# EasyEDA Pro project ProPrj_MCC_2024_final_2024-12-02.epro

# Schematic MCC_2024_V1
Board Name: MCC_2024_V1; Create Date: 2024-10-15; Page Name: P1; Project Name: MCC_2024_final; Schematic Name: MCC_2024_V1; Update Date: 2024-10-15; Company: alejnd; Drawn: naja; Page Size: A4; Part Number: JLCPCB-002; Reviewed: nikk0r; Version: V0.1
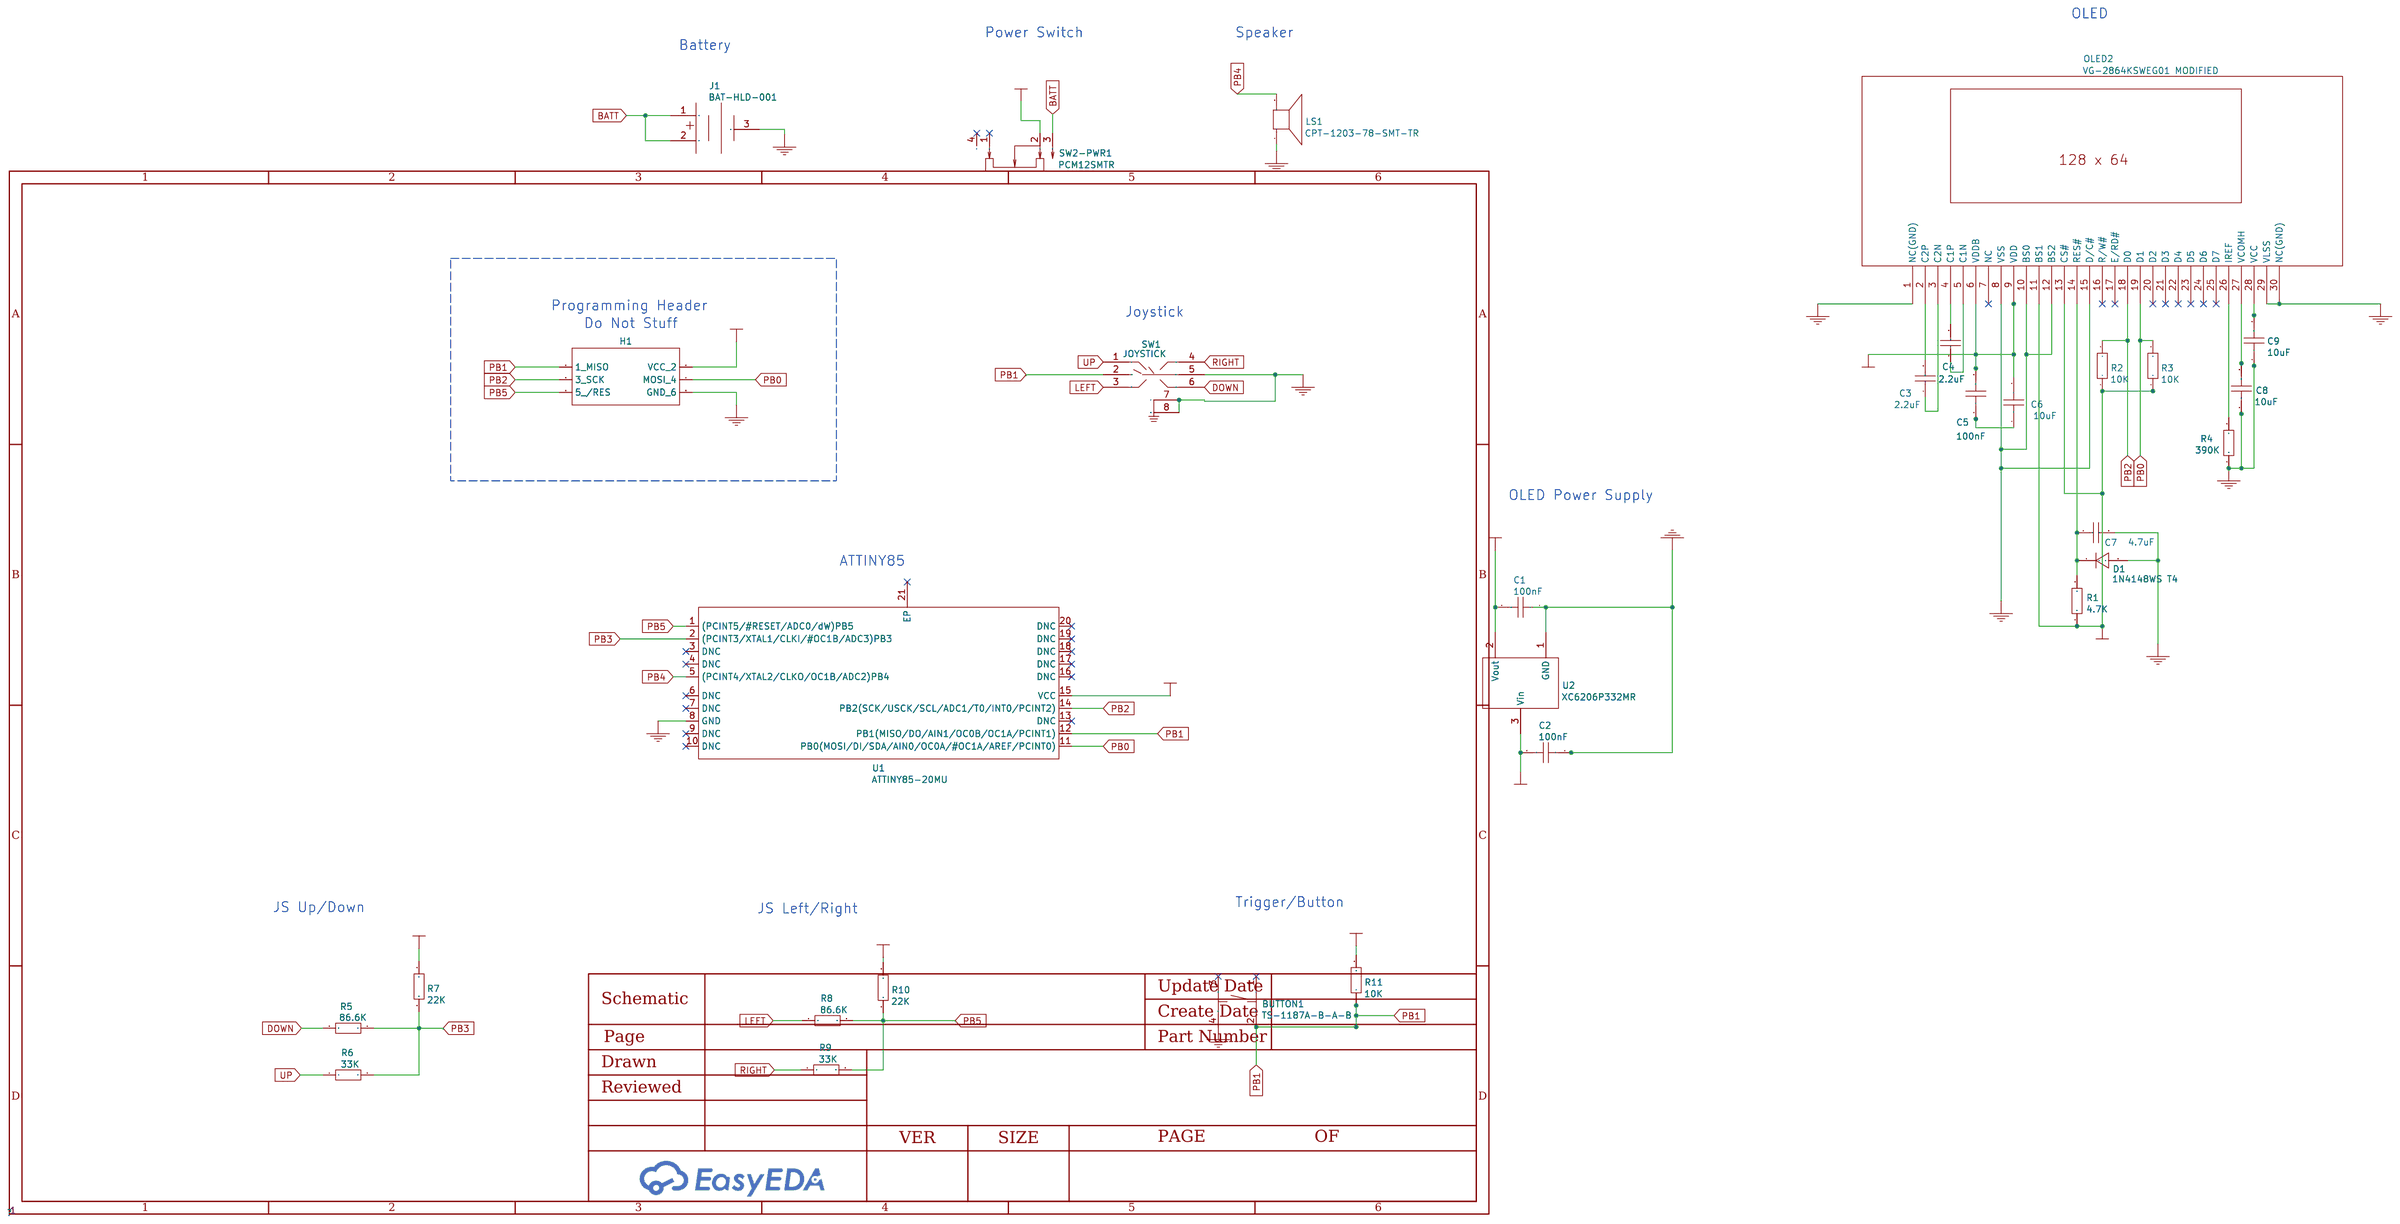
[diagram p0: schematic sheet]

## Parts
BUTTON1  TS-1187A-B-A-B  [SW-SMD_4P-L5.1-W5.1-P3.70-LS6.4]
C1  100nF  [C0603]
C2  100nF  [C0603]
C3  2.2uF  [C0603]
C4  2.2uF  [C0603]
C5  100nF  [C0603]
C6  10uF  [C0603]
C7  4.7uF  [C0603]
C8  10uF  [C0603]
C9  10uF  [C0603]
D1  1N4148WS T4  [SOD-323_L1.8-W1.3-LS2.5-RD]
H1  ISP HEADER  [HDR-TH_6P-P2.54-V-R2-C3-S2.54]
J1  BAT-HLD-001  [BAT-HLD-001]
LS1  CPT-1203-78-SMT-TR  [XDCR_CPT-1203-78-SMT-TR]
OLED2  VG-2864KSWEG01 MODIFIED  [OLED_0.96-30P-P0.70-12864]
R1  4.7K  [R0603]
R2  10K  [R0603]
R3  10K  [R0603]
R4  390K  [R0603]
R5  86.6K  [R0603]
R6  33K  [R0603]
R7  22K  [R0603]
R8  86.6K  [R0603]
R9  33K  [R0603]
R10  22K  [R0603]
R11  10K  [R0603]
SW1  JOYSTICK  [SW-SMD_SKRHADE010]
SW2-PWR1  PCM12SMTR  [SW-SMD_PCM12SMTR]
U1  ATTINY85-20MU  [QFN-20_L4.0-W4.0-P0.50-BL-EP]
U2  XC6206P332MR  [SOT-23-3_L2.9-W1.6-P1.90-LS2.8-BR]

## Library data of the parts
BUTTON1 = TS-1187A-B-A-B: Supplier: LCSC; Supplier Part: C318884; Manufacturer: XKB Enterprise; JLCPCB Part Class: Extend
C1 C2 C5 = CC0603KRX7R9BB104: Supplier: LCSC; Manufacturer: YAGEO; Supplier Part: C14663; JLCPCB Part Class: Basic
C3 C4 = CL10A225KO8NNNC: Supplier: LCSC; Manufacturer: SAMSUNG; Supplier Part: C23630; JLCPCB Part Class: Basic
C6 C8 C9 = CL10A106KP8NNNC: Supplier: LCSC; Manufacturer: SAMSUNG; Supplier Part: C19702; JLCPCB Part Class: Basic
C7 = CL10A475KO8NNNC: Supplier: LCSC; Manufacturer: SAMSUNG; Supplier Part: C19666; JLCPCB Part Class: Basic
D1 = 1N4148WS T4: Supplier: LCSC; Manufacturer: CJ; image: //image.lceda.cn/szlcsc/C2128.jpg; Supplier Part: C2128; JLCPCB Part Class: Basic
H1 = DS1023-2*3SF11: Supplier: LCSC; Manufacturer: CONNFLY; Supplier Part: C92272
J1 = BAT-HLD-001
LS1 = CUI Devices: Supplier: Mouser; Supplier Part: 490-CPT-1203-78SMTTR
OLED2 = VG-2864KSWEG01: Supplier: LCSC; Supplier Part: C194313; Manufacturer: WiseChip
R1 = 0603WAF4701T5E: Supplier: LCSC; Manufacturer: UniOhm; Supplier Part: C23162; JLCPCB Part Class: Basic
R2 R3 R11 = 0603WAF1002T5E: Supplier: LCSC; Manufacturer: UniOhm; Supplier Part: C25804; JLCPCB Part Class: Basic
R4 = 0603WAF3903T5E: Supplier: LCSC; Manufacturer: UniOhm; Supplier Part: C23150; JLCPCB Part Class: Basic
R5 R8 = 0603WAF8662T5E: Supplier: LCSC; Manufacturer: UniOhm; Supplier Part: C23121; JLCPCB Part Class: Extend
R6 R9 = 0603WAF3302T5E: Supplier: LCSC; Manufacturer: UniOhm; Supplier Part: C4216; JLCPCB Part Class: Basic
R7 R10 = 0603WAF2202T5E: Supplier: LCSC; Manufacturer: UniOhm; Supplier Part: C31850; JLCPCB Part Class: Basic
SW1 = SKRHADE011: Supplier: LCSC; Supplier Part: C602036; Manufacturer: ALPS Electric
SW2-PWR1 = PCM12SMTR: Supplier: LCSC; Supplier Part: C221841; Manufacturer: C&K
U1 = ATTINY85-20MU: Supplier: LCSC; Supplier Part: C1337171; Manufacturer: Microchip Tech; JLCPCB Part Class: Extended Part
U2 = XC6206P332MR: Supplier: LCSC; Manufacturer: TOREX; image: //image.lceda.cn/szlcsc/C5446.jpg; Supplier Part: C5446; JLCPCB Part Class: Basic

## Nets
3.3V: C1.2 C5.2 C6.2 OLED2.6(VDDB) OLED2.9(VDD) OLED2.11(BS1) OLED2.13(CS#) R1.1 R2.1 R3.1 U2.2(Vout)
GND: BUTTON1.4(D) C1.1 C2.1 C7.2 C8.1 C9.1 D1.2(A) H1.6(GND 6) J1.3(2) LS1.N OLED2.1(NC(GND)) OLED2.8(VSS) OLED2.10(BS0) OLED2.12(BS2) OLED2.15(D/C#) OLED2.29(VLSS) OLED2.30(NC(GND)) R4.1 SW1.5(COM) SW1.7 SW1.8 U1.8(GND) U2.1(GND)
VCC: C2.2 H1.2(VCC 2) R7.1 R10.2 R11.2 SW2-PWR1.2 U1.15(VCC) U2.3(Vin)
BATT: J1.1 J1.2(1) SW2-PWR1.3
DOWN: R5.2 SW1.6(D)
LEFT: R8.1 SW1.3(C)
PB0: H1.4(MOSI 4) OLED2.19(D1) R3.2 U1.11(PB0(MOSI/DI/SDA/AIN0/OC0A/#OC1A/AREF/PCINT0))
PB1: BUTTON1.2(B) H1.1(1 MISO) R11.1 SW1.2(CEN) U1.12(PB1(MISO/DO/AIN1/OC0B/OC1A/PCINT1))
PB2: H1.3(3 SCK) OLED2.18(D0) R2.2 U1.14(PB2(SCK/USCK/SCL/ADC1/T0/INT0/PCINT2))
PB3: R5.1 R6.2 R7.2 U1.2((PCINT3/XTAL1/CLKI/#OC1B/ADC3)PB3)
PB4: LS1.P U1.5((PCINT4/XTAL2/CLKO/OC1B/ADC2)PB4)
PB5: H1.5(5 /RES) R8.2 R9.2 R10.1 U1.1((PCINT5/#RESET/ADC0/dW)PB5)
RIGHT: R9.1 SW1.4(B)
UP: R6.1 SW1.1(A)
$1N1548: C7.1 D1.1(K) OLED2.14(RES#) R1.2
$1N1551: C5.1 C6.1
$1N1555: C9.2 OLED2.28(VCC)
$1N1556: C8.2 OLED2.27(VCOMH)
$1N1559: C3.1 OLED2.3(C2N)
$1N1560: C3.2 OLED2.2(C2P)
$1N1564: OLED2.26(IREF) R4.2
$1N1567: C4.2 OLED2.4(C1P)
$1N1568: C4.1 OLED2.5(C1N)

Not connected (* = marked no-connect by the designer): BUTTON1 1(A)* 3(C)*; OLED2 7(NC)* 16(R/W#)* 17(E/RD#)* 20(D2)* 21(D3)* 22(D4)* 23(D5)* 24(D6)* 25(D7)*; SW2-PWR1 1* 4*; U1 3(DNC)* 4(DNC)* 6(DNC)* 7(DNC)* 9(DNC)* 10(DNC)* 13(DNC)* 16(DNC)* 17(DNC)* 18(DNC)* 19(DNC)* 20(DNC)* 21(EP)*

## Notes on the sheet
- OLED
- Power Switch
- Speaker
- Battery
- Programming Header
- Joystick
- Do Not Stuff
- OLED Power Supply
- ATTINY85
- Trigger/Button
- JS Up/Down
- JS Left/Right

# Board MCC_2024_V1
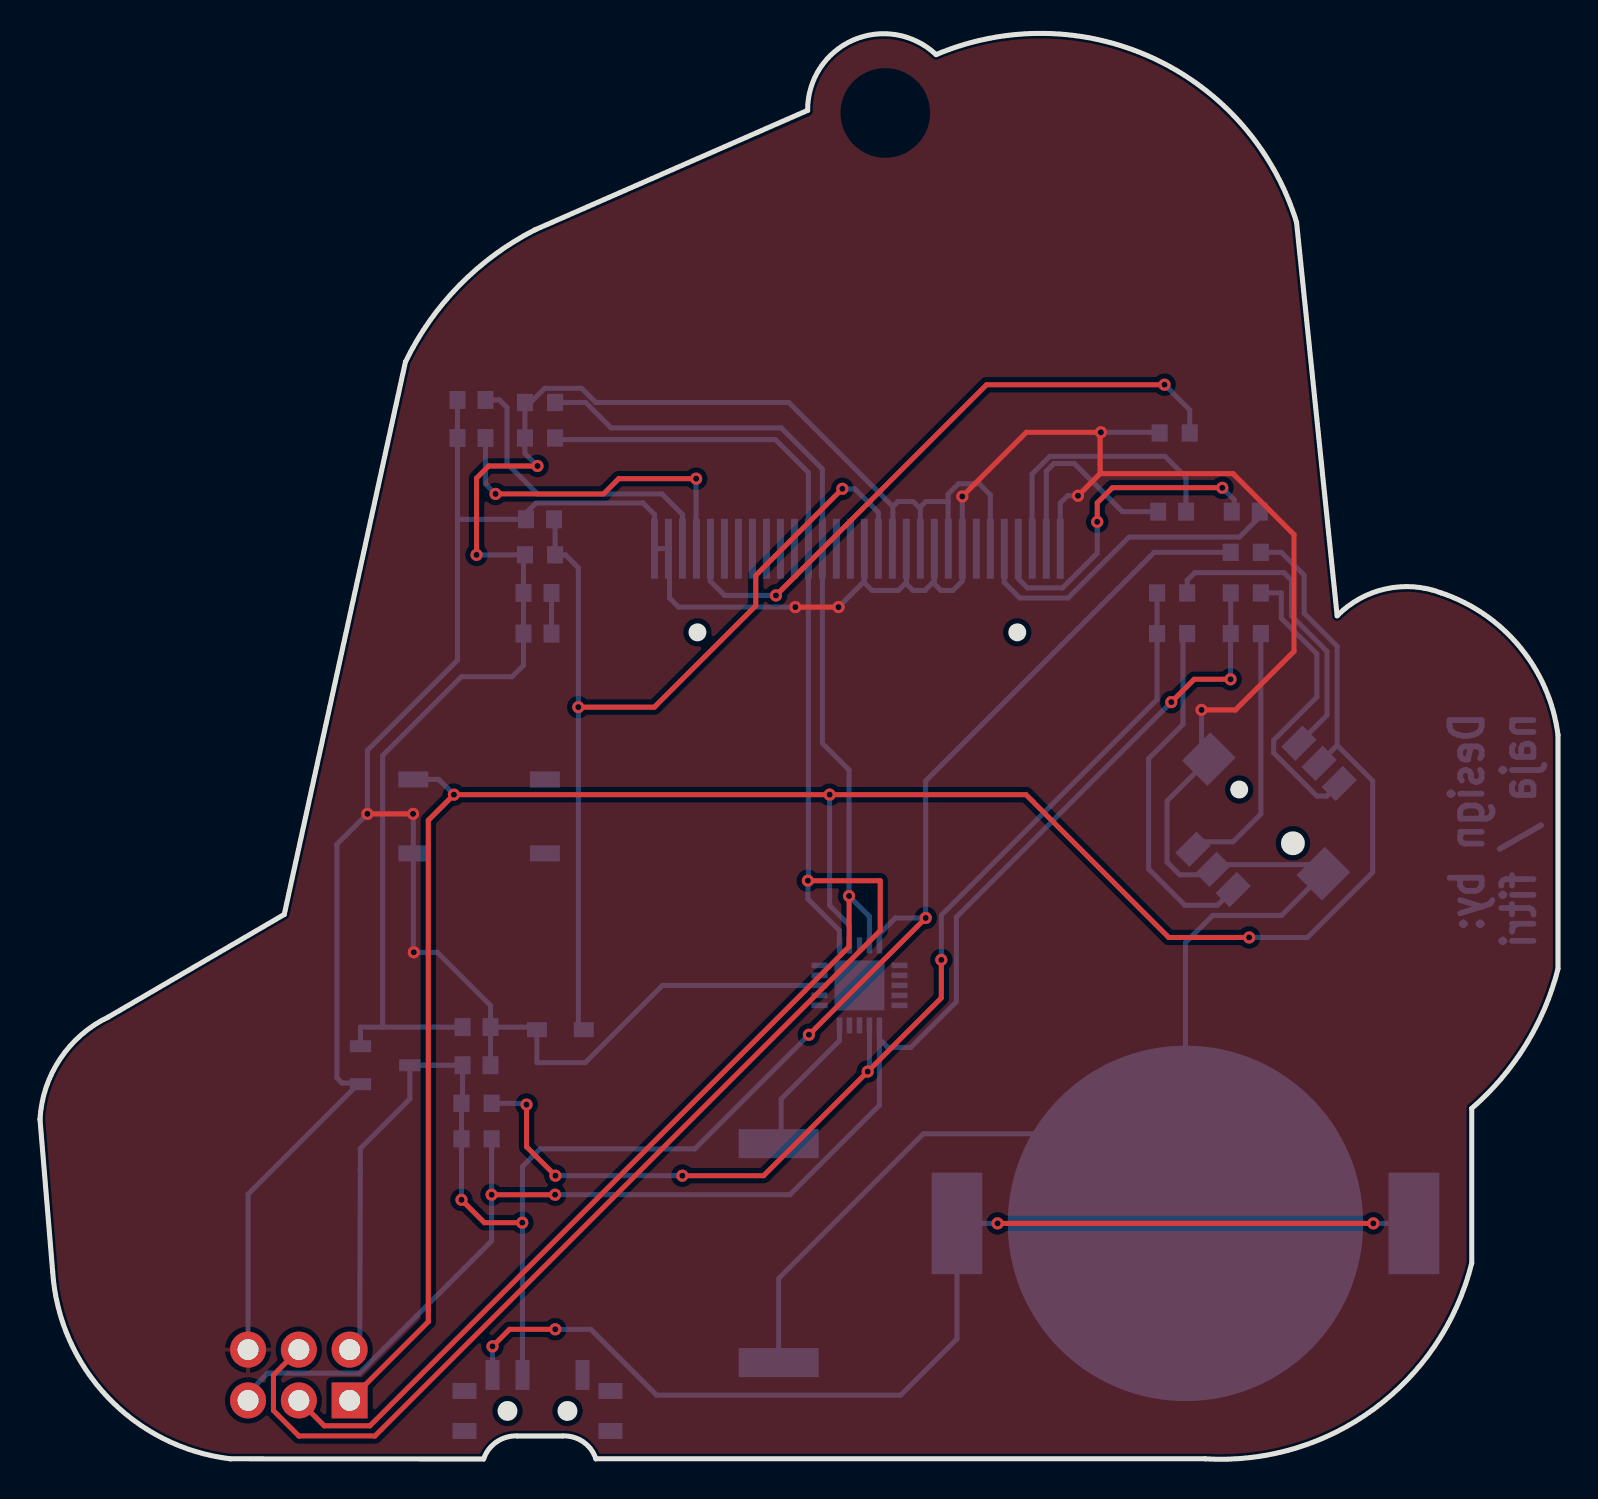
[diagram p1: board, top side]
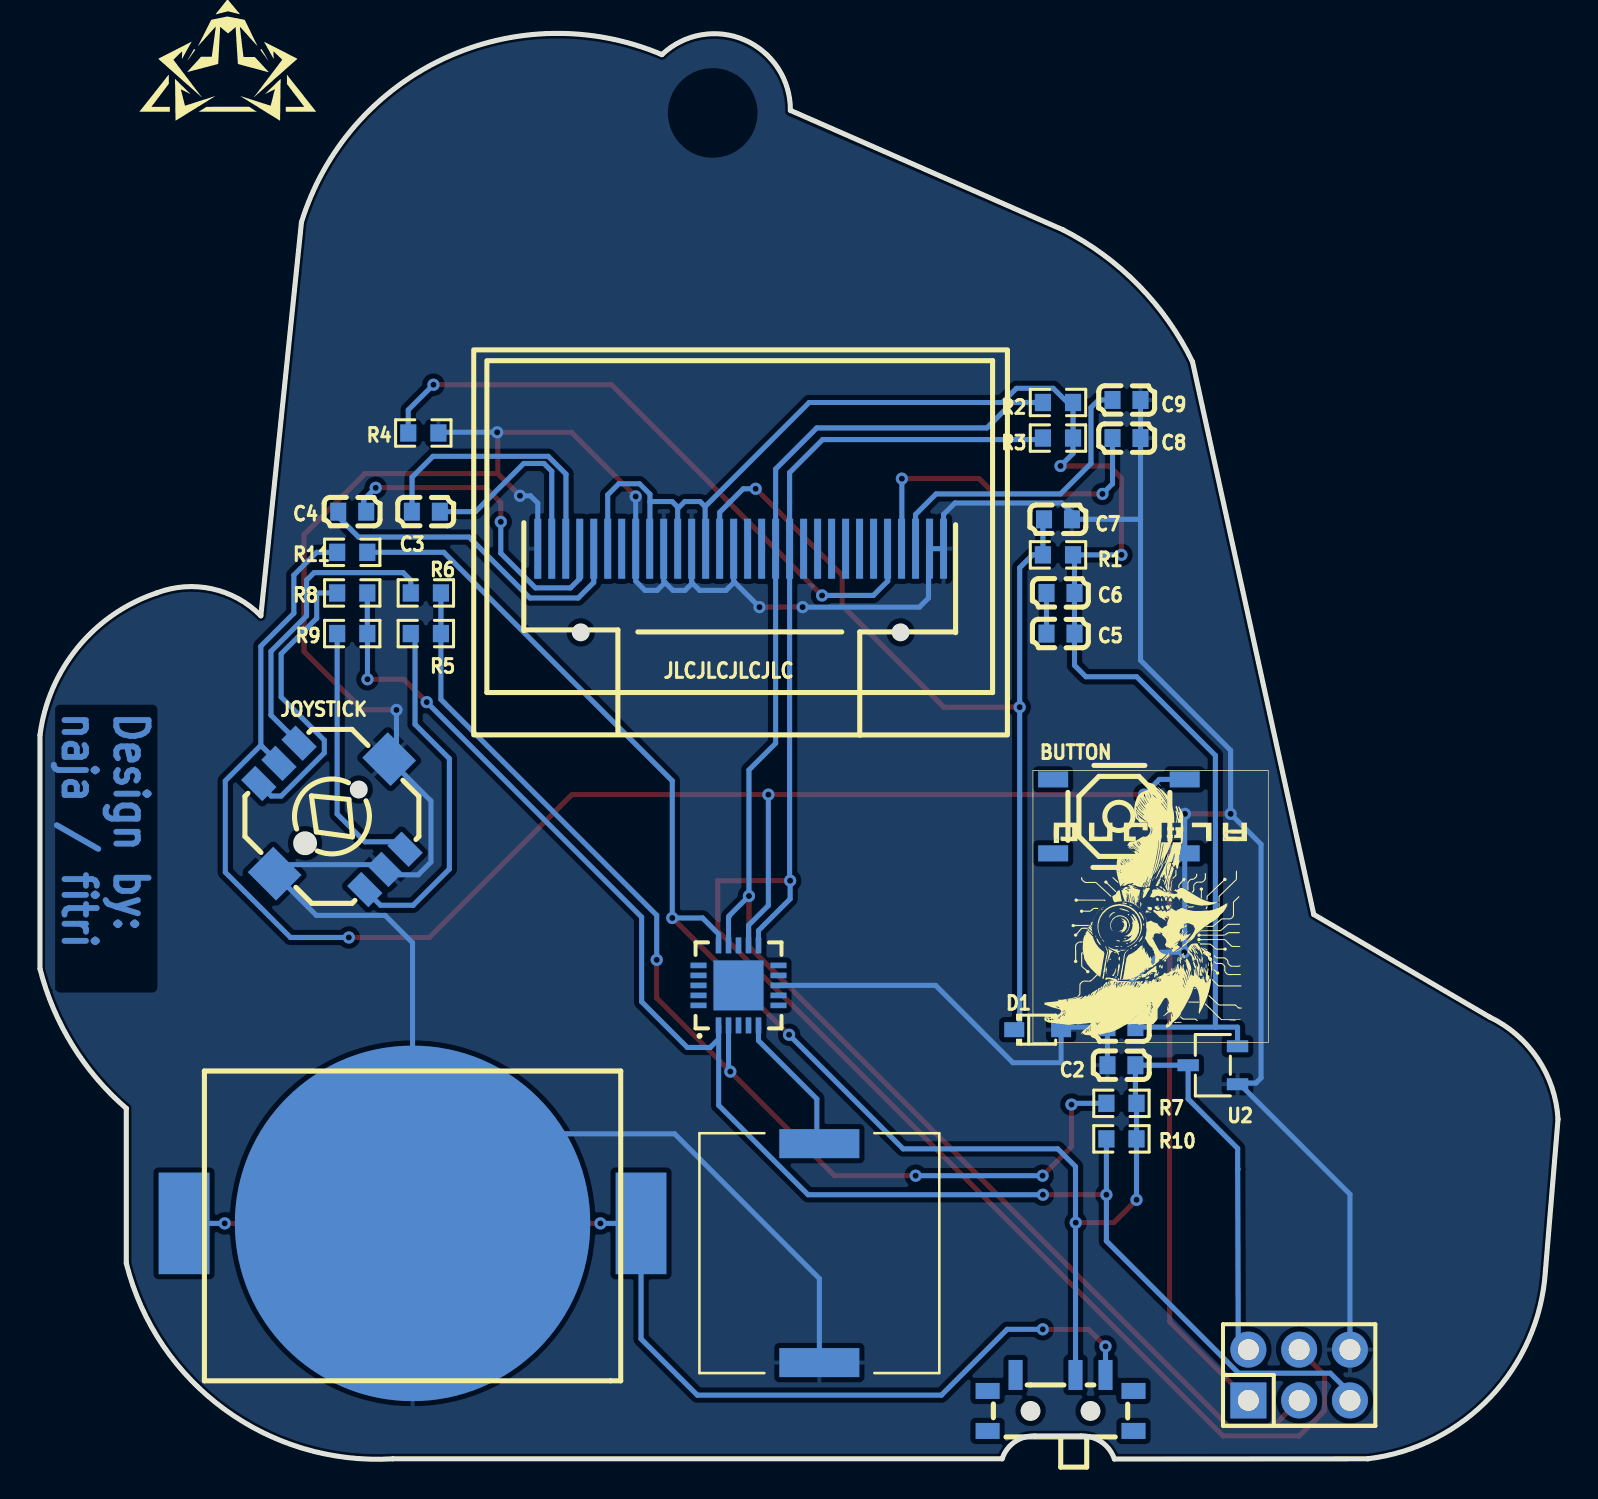
[diagram p2: board, bottom side, seen from below]

Outline 75.94 x 71.32 mm; copper layers: Top Layer, Bottom Layer. Coordinates in mm from the lower left corner of the outline.
Outline path: 0,17.01 arc(1.01,20.03) 3.42,22.12 12.22,27.25 18.28,54.89 arc(20.98,58.72) 24.76,61.49 38.4,67.47 arc(40.69,70.99) 44.83,70.25 arc(55.71,70.07) 62.86,61.87 64.89,42.19 arc(67.33,43.53) 70.1,43.33 arc(74.04,40.61) 75.94,36.22 75.94,24.53 arc(74.32,20.71) 71.62,17.55 71.62,9.8 arc(66.72,2.51) 58.29,0.02 27.81,0.02 arc(27.18,0.87) 26.16,1.17 23.87,1.17 arc(22.84,0.87) 22.19,0.01 9.52,0.02 arc(3.38,3.12) 0.63,9.42 0,17.01
Stack: Top Layer 0.035mm / Dielectric1 1.51mm FR4 er 4.5 / Bottom Layer 0.035mm

## Design rules (mm)
template: JLCPCB Capability(Two Layers Board)
spacing copperThickness1oz (default): track to track 0.102, other pairs 0.152 to 0.3
spacing copperThickness2oz: track to track 0.203, other pairs 0.152 to 0.3
track width copperThickness1oz (default): min 0.127, default 0.254, max 2.54
track width copperThickness2oz: min 0.203, default 0.254, max 2.54
differential pair differentialPair (default): width min 0.127, default 0.254, max 2.54; gap min 0.152, default 0.152
via viaSize (default): diameter min 0.5, default 0.61, max 10; hole min 0.3, default 0.305, max 6.3

## Placement (name value [footprint] x y rotation side)
BUTTON  TS-1187A-B-A-B  [SW-SMD_4P-L5.1-W5.1-P3.70-LS6.4]  21.97 32.15 180 bottom
C1  100nF  [C0603]  21.84 21.61 180 bottom
C2  100nF  [C0603]  21.84 19.71 180 bottom
C3  2.2uF  [C0603]  56.64 47.39 180 bottom
C4  2.2uF  [C0603]  60.32 47.39 180 bottom
C5  100nF  [C0603]  24.89 41.3 180 bottom
C6  10uF  [C0603]  24.89 43.33 180 bottom
C7  4.7uF  [C0603]  25.01 47.01 180 bottom
C8  10uF  [C0603]  21.59 51.08 0 bottom
C9  10uF  [C0603]  21.59 52.98 0 bottom
D1  1N4148WS T4  [SOD-323_L1.8-W1.3-LS2.5-RD]  26.03 21.49 180 bottom
H1  ISP HEADER  [HDR-TH_6P-P2.54-V-R2-C3-S2.54]  12.95 4.21 180 bottom
J1  -  [BAT-HLD-001]  57.3 11.8 0 bottom
JOYSTICK  JOYSTICK  [SW-SMD_SKRHADE010]  61.34 32.15 270 bottom
LS1  CPT-1203-78-SMT-TR  [XDCR_CPT-1203-78-SMT-TR]  36.95 10.31 180 bottom
OLED2  VG-2864KSWEG01 MODIFIED  [OLED_0.96-30P-P0.70-12864]  41.14 22.63 180 bottom
R1  4.7K  [R0603]  25.01 45.24 0 bottom
R2  10K  [R0603]  25.01 52.86 0 bottom
R3  10K  [R0603]  25.01 51.08 0 bottom
R4  390K  [R0603]  56.76 51.33 0 bottom
R5  86.6K  [R0603]  56.64 41.3 0 bottom
R6  33K  [R0603]  56.64 43.33 180 bottom
R7  22K  [R0603]  21.84 17.8 0 bottom
R8  86.6K  [R0603]  60.32 43.33 180 bottom
R9  33K  [R0603]  60.32 41.3 180 bottom
R10  22K  [R0603]  21.84 16.03 180 bottom
R11  10K  [R0603]  60.32 45.36 180 bottom
SW2-PWR1  PCM12SMTR  [SW-SMD_PCM12SMTR]  24.89 2.82 180 bottom
U1  ATTINY85-20MU  [QFN-20_L4.0-W4.0-P0.50-BL-EP]  41 23.7 180 bottom
U2  XC6206P332MR  [SOT-23-3_L2.9-W1.6-P1.90-LS2.8-BR]  17.27 19.71 180 bottom

## Footprints (pads in the part's own frame, mm; a bottom-side part is the same pattern mirrored in y, then rotated)
BAT-HLD-001
  rect 2.54x5.08 smd: 1(-11.43,0) 2(11.43,0)
  round 17.78 smd: 3(0,0)
C0603
  rect 0.8x0.9 smd: 1(-0.7,0) 2(0.7,0)
HDR-TH_6P-P2.54-V-R2-C3-S2.54
  rect 1.8x1.8 hole 1.05: 1(-2.54,-1.27)
  round 1.8 hole 1.05: 2(-2.54,1.27) 3(0,-1.27) 4(0,1.27) 5(2.54,-1.27) 6(2.54,1.27)
OLED_0.96-30P-P0.70-12864
  rect 0.35x3 smd: 1(-9.896,22.909) 2(-9.196,22.911) 3(-8.496,22.911) 4(-7.796,22.911) 5(-7.096,22.911) 6(-6.396,22.911) 7(-5.696,22.911) 8(-4.996,22.911) 9(-4.296,22.911) 10(-3.596,22.911) 11(-2.896,22.911) 12(-2.196,22.911) 13(-1.496,22.911) 14(-0.796,22.911) 15(-0.096,22.911) 16(0.604,22.911) 17(1.304,22.911) 18(2.004,22.911) 19(2.704,22.911) 20(3.404,22.911) 21(4.104,22.911) 22(4.804,22.911) 23(5.504,22.911) 24(6.204,22.911) 25(6.904,22.911) 26(7.604,22.911) 27(8.304,22.911) 28(9.004,22.913) 29(9.704,22.913) 30(10.404,22.913)
QFN-20_L4.0-W4.0-P0.50-BL-EP
  rect 0.28x0.8 smd: 1(-1,-2) 2(-0.5,-2) 3(0,-2) 4(0.5,-2) 5(1,-2) 11(1,2) 12(0.5,2) 13(0,2) 14(-0.5,2) 15(-1,2)
  rect 0.8x0.28 smd: 6(2,-1) 7(2,-0.5) 8(2,0) 9(2,0.5) 10(2,1) 16(-2,1) 17(-2,0.5) 18(-2,0) 19(-2,-0.5) 20(-2,-1)
  rect 2.5x2.5 smd: 21(0,0)
R0603
  rect 0.806x0.864 smd: 1(-0.753,0) 2(0.753,0)
SOD-323_L1.8-W1.3-LS2.5-RD
  rect 1x0.75 smd: 1(-1.173,0) 2(1.173,0)
SOT-23-3_L2.9-W1.6-P1.90-LS2.8-BR
  rect 1.07x0.6 smd: 1(1.235,-0.95) 2(1.235,0.95) 3(-1.235,0)
SW-SMD_4P-L5.1-W5.1-P3.70-LS6.4
  rect 1.5x0.8 smd: 1(-3.291,1.85) 2(3.291,1.85) 3(-3.291,-1.85) 4(3.291,-1.85)
SW-SMD_PCM12SMTR
  rect 0.7x1.5 smd: 1(-2.25,1.4) 2(0.75,1.4) 3(2.25,1.4)
  rect 1.2x0.8 smd: 4(-3.65,-1.4) 4(-3.65,0.6) 4(3.65,-1.4) 4(3.65,0.6)
SW-SMD_SKRHADE010
  rect 1.5x1 smd rot 135: 1(-3.659,-1.644) 2(-2.651,-2.652) 3(-1.644,-3.659) 4(1.644,3.659) 5(2.651,2.652) 6(3.659,1.644)
  rect 2x1.8 smd rot 135: 7(-2.864,2.864) 8(2.864,-2.864)
XDCR_CPT-1203-78-SMT-TR
  rect 4x1.45 smd: N(0,-5.475) P(0,5.475)

## Nets
3.3V: C1.2 C5.2 C6.2 OLED2.6 OLED2.9 OLED2.11 OLED2.13 R1.1 R2.1 R3.1 U2.2
GND: BUTTON.4 C1.1 C2.1 C7.2 C8.1 C9.1 D1.2 H1.6 J1.3 JOYSTICK.5 JOYSTICK.7 JOYSTICK.8 LS1.N OLED2.1 OLED2.8 OLED2.10 OLED2.12 OLED2.15 OLED2.29 OLED2.30 R4.1 U1.8 U2.1
VCC: C2.2 H1.2 R7.1 R10.2 R11.2 SW2-PWR1.2 U1.15 U2.3
BATT: J1.1 J1.2 SW2-PWR1.3
DOWN: JOYSTICK.6 R5.2
LEFT: JOYSTICK.3 R8.1
PB0: H1.4 OLED2.19 R3.2 U1.11
PB1: BUTTON.2 H1.1 JOYSTICK.2 R11.1 U1.12
PB2: H1.3 OLED2.18 R2.2 U1.14
PB3: R5.1 R6.2 R7.2 U1.2
PB4: LS1.P U1.5
PB5: H1.5 R8.2 R9.2 R10.1 U1.1
RIGHT: JOYSTICK.4 R9.1
UP: JOYSTICK.1 R6.1
$1N1548: C7.1 D1.1 OLED2.14 R1.2
$1N1551: C5.1 C6.1
$1N1555: C9.2 OLED2.28
$1N1556: C8.2 OLED2.27
$1N1559: C3.1 OLED2.3
$1N1560: C3.2 OLED2.2
$1N1564: OLED2.26 R4.2
$1N1567: C4.2 OLED2.4
$1N1568: C4.1 OLED2.5

Pads without a net: BUTTON 1 3; OLED2 7 16 17 20 21 22 23 24 25; SW2-PWR1 1 4; U1 3 4 6 7 9 10 13 16 17 18 19 20 21

## Via types
v1: diameter 0.61, hole 0.305, Top Layer to Bottom Layer, 41 vias

## Routing (per net, layer and track width the routed paths; a pad name or vN(x,y) marks a point on that pad's centre or on a via; arc(x,y) is an arc through that point)
3.3V: length 83.6
  Top Layer w0.254: v1(24.89,49.68) 22.45,49.68 21.84,49.07 v1(21.84,45.23)
  Bottom Layer w0.252: 45.43,47.9 45.43,45.55 OLED2.9 ; 45.43,47.9 44.32,47.9 44.04,47.62 44.04,47.54 ; 45.43,47.9 45.43,48.27 45.95,48.79 46.99,48.79 47.54,48.23 OLED2.6 ; 44.04,47.54 43.69,47.9 42.92,47.9 42.67,47.65 ; 44.04,47.54 OLED2.11 ; C6.2 24.19,45.23 ; 42.67,47.65 42.67,45.57 OLED2.13 ; 42.67,47.65 37.46,52.85 27.8,52.85 27.09,53.56 25.25,53.56 24.54,52.85 R2.1
  Bottom Layer w0.254: C6.2 C5.2 24.19,39.71 23.62,39.14 21.08,39.14 17.14,35.2 17.14,21.61 ; R2.1 R3.1 24.26,50.3 v1(24.89,49.68) ; R1.1 v1(21.84,45.23) ; 17.14,21.61 C1.2 ; 17.14,21.61 16.03,21.61 U2.2
GND: length 241.1
  Top Layer w0.252: v1(53.07,51.37) 49.35,51.37 v1(46.14,48.16)
  Top Layer w0.254: v1(37.79,42.62) v1(39.95,42.62) ; v1(53.07,51.37) 53.04,51.33 53.04,49.3 ; 53.04,49.3 59.69,49.3 62.73,46.25 62.73,40.41 59.8,37.48 v1(58.11,37.48) ; 53.04,49.3 v1(51.93,48.19) ; v1(16.38,32.28) v1(18.66,32.28)
  Bottom Layer w0.252: OLED2.29 OLED2.30 ; v1(51.93,48.19) 51.41,48.19 51.04,47.82 OLED2.1 ; v1(58.11,37.48) 58.11,35.38 JOYSTICK.7 56.38,32.93 56.38,29.87 57.02,29.23 58.42,29.23 JOYSTICK.5 58.92,29.74 63.75,29.74 JOYSTICK.8 ; U1.8 31.14,23.7 27.27,19.84 24.86,19.84 D1.2 ; J1.3 52.82,16.28 44.19,16.28 36.95,9.04 LS1.N ; v1(46.14,48.16) OLED2.8 46.14,43.92
  Bottom Layer w0.254: v1(18.66,32.28) 18.68,32.27 BUTTON.4 18.68,25.38 v1(18.7,25.35) 19.87,25.36 22.54,22.69 C1.1 ; C1.1 24.73,21.61 D1.2 ; C1.1 C2.1 ; 41.2,43.88 41.62,43.46 42.94,43.46 43.34,43.86 ; 41.2,43.88 v1(39.95,42.62) ; 41.2,43.88 41.24,43.91 OLED2.15 ; 20.89,47.01 C8.1 C9.1 ; 20.89,47.01 20.89,39.96 16.38,35.46 v1(16.38,32.28) 14.86,30.76 14.86,19.07 15.11,18.82 15.97,18.82 10.41,13.26 10.41,5.48 ; 20.89,47.01 20.89,47.01 C7.2 24.31,47.33 24.81,47.83 30.17,47.83 30.74,47.26 OLED2.30 ; 44.67,43.85 44.74,43.92 OLED2.10 ; 44.67,43.85 45.07,43.46 45.67,43.46 46.14,43.92 ; 44.67,43.85 44.28,43.46 43.68,43.46 43.34,43.79 43.34,43.86 ; J1.3 57.3,25.83 58.67,27.2 62.11,27.2 JOYSTICK.8 ; R4.1 55.98,51.37 v1(53.07,51.37) ; OLED2.12 43.34,43.86 ; v1(37.79,42.62) 31.95,42.62 31.49,43.08 31.49,45.49 OLED2.29
VCC: length 94.2
  Top Layer w0.252: v1(38.47,21.23) v1(44.31,27.07)
  Top Layer w0.254: v1(21.09,12.98) 22.23,11.83 v1(24.13,11.83)
  Bottom Layer w0.252: 25.02,15.52 32.76,15.52 v1(38.47,21.23) ; U1.15 42,26.27 42.79,27.07 v1(44.31,27.07) 44.31,33.93 55.74,45.36 R11.2
  Bottom Layer w0.254: SW2-PWR1.2 24.14,14.64 25.02,15.52 ; v1(21.09,12.97) R10.2 R7.1 21.14,17.85 C2.2 18.5,19.71 18.5,18.02 16.03,15.54 16.03,14.52 ; 16.01,14.5 16.03,14.52 ; 16.03,14.52 16,5.99 15.49,5.48
BATT: length 56.2
  Top Layer w0.254: v1(22.64,5.64) 23.49,6.5 v1(25.78,6.5) ; v1(66.7,11.8) v1(47.91,11.8)
  Bottom Layer w0.254: v1(22.64,5.64) SW2-PWR1.3 ; v1(25.78,6.5) 27.56,6.5 30.85,3.2 43.06,3.2 45.87,6.02 J1.1 v1(47.91,11.8) ; J1.2 v1(66.7,11.8)
DOWN: length 17.9
  Bottom Layer w0.254: R5.2 57.18,41.09 57.18,36.76 55.46,35.04 55.46,29.52 57.27,27.71 58.91,27.71 59.69,28.49
LEFT: length 15.1
  Bottom Layer w0.252: R8.1 62.1,43.33 62.1,42.06 63.88,40.28 63.88,38.12 61.72,35.96 61.72,35.33 63.88,33.17 64.37,33.17 JOYSTICK.3
PB0: length 88.7
  Top Layer w0.252: v1(38.41,28.94) 42.03,28.94 42.03,26.44 16.76,1.17 12.95,1.17 11.68,2.44 11.68,4.21 12.95,5.48
  Bottom Layer w0.252: U1.11 40,26.44 38.41,28.03 v1(38.41,28.94) 38.44,28.96 OLED2.19 38.44,47.83
  Bottom Layer w0.254: R3.2 25.84,51 36.79,51 38.44,49.35 38.44,47.83
PB1: length 113.2
  Top Layer w0.254: H1.1 19.43,6.88 19.43,31.96 v1(20.71,33.24) v1(39.5,33.24) 49.33,33.24 56.47,26.1 v1(60.49,26.1)
  Bottom Layer w0.252: v1(20.71,33.24) 19.95,34 BUTTON.2 ; v1(60.49,26.1) 63.41,26.1 66.67,29.36 66.67,33.93 64.89,35.71 ; v1(39.5,33.24) 39.5,27.69 40.5,26.7 40.5,25.7
  Bottom Layer w0.254: 63.99,34.8 64.89,35.71 64.89,40.66 63.24,42.31 63.24,44.22 62.1,45.36 R11.1
PB2: length 80.1
  Top Layer w0.252: H1.3 14.22,1.67 16.51,1.67 40.47,25.64 v1(40.47,28.17)
  Bottom Layer w0.252: 41.5,25.7 41.5,27.1 41.47,27.13 41.47,27.17 v1(40.47,28.17) 40.47,34.47 39.14,35.81 39.14,47.83
  Bottom Layer w0.254: R2.2 27.3,52.86 28.57,51.59 37.08,51.59 39.14,49.53 39.14,47.83
PB3: length 56
  Top Layer w0.252: v1(45.09,24.98) 45.09,23.07 v1(41.41,19.39) 36.2,14.18 v1(32.14,14.18) ; v1(25.79,14.18) 24.34,15.63 v1(24.34,17.74)
  Bottom Layer w0.252: v1(45.09,24.98) 45.09,27.21 55.88,38 R5.1 ; v1(41.41,19.39) 41.5,19.48 41.5,21.7 ; v1(32.14,14.18) v1(25.79,14.18)
  Bottom Layer w0.254: v1(24.34,17.74) 24.28,17.8 R7.2 22.59,17.81 ; R5.1 R6.2
PB4: length 7.2
  Bottom Layer w0.252: U1.5 40,20.94 37.08,18.02 37.08,15.91 LS1.P
PB5: length 78.9
  Top Layer w0.252: v1(56.59,37.87) 57.74,39.01 v1(59.56,39.01) ; v1(22.59,13.23) v1(25.77,13.23)
  Bottom Layer w0.252: 41.99,21.69 41.99,17.7 37.52,13.23 v1(25.77,13.23) ; v1(59.56,39.01) 59.56,41.29 R9.2 ; v1(56.59,37.87) 45.84,27.11 45.84,22.88 43.56,20.59 42.41,20.59 42,21.01 U1.1
  Bottom Layer w0.254: R9.2 R8.2 ; R10.1 v1(22.59,13.23) 22.59,10.92 15.98,4.3 11.39,4.3 10.41,3.32 H1.5
RIGHT: length 13.2
  Bottom Layer w0.254: 57.68,30.51 58.05,30.88 59.69,30.88 61.07,32.27 R9.1
UP: length 15.6
  Bottom Layer w0.254: R6.1 57.39,43.96 57.77,44.34 62.23,44.34 62.61,43.96 62.61,42.18 64.38,40.41 64.38,37.21 JOYSTICK.1
$1N1548: length 49.2
  Top Layer w0.254: v1(40.14,48.54) 35.81,44.21 35.81,42.69 30.73,37.61 v1(26.93,37.61)
  Bottom Layer w0.254: D1.1 26.93,21.76 v1(26.93,37.61) 26.93,44.59 26.28,45.23 R1.2 25.77,46.96 C7.1 ; OLED2.14 41.94,47.36 40.76,48.54 v1(40.14,48.54)
$1N1551: length 2
  Bottom Layer w0.254: C5.1 25.59,41.3 25.59,43.33 C6.1
$1N1555: length 15.6
  Bottom Layer w0.254: 22.29,52.85 22.41,52.98 22.98,52.98 23.36,52.6 23.36,49.8 24.89,48.28 31.11,48.28 32.14,47.25 OLED2.28
$1N1556: length 16.9
  Top Layer w0.254: v1(22.79,48.28) 28.19,48.28 28.95,49.05 v1(32.82,49.05)
  Bottom Layer w0.254: C8.2 22.29,48.79 v1(22.79,48.28) ; v1(32.82,49.04) 32.82,45.55 OLED2.27
$1N1559: length 13.9
  Bottom Layer w0.254: 49.64,45.63 49.63,45.64 49.63,49.27 50.52,50.16 56.28,50.16 57.33,49.12 57.33,47.4 C3.1
$1N1560: length 10.7
  Bottom Layer w0.254: OLED2.2 50.34,49.42 50.73,49.81 51.74,49.81 54.15,47.39 55.81,47.39 55.94,47.27
$1N1564: length 31.9
  Top Layer w0.254: v1(56.26,53.74) 47.36,53.74 v1(36.82,43.21)
  Bottom Layer w0.252: v1(56.26,53.74) 57.52,52.48 R4.2
  Bottom Layer w0.254: OLED2.26 33.53,45.53 33.53,43.92 34.25,43.2 v1(36.82,43.2)
$1N1567: length 17
  Top Layer w0.254: v1(59.15,48.59) 59.14,48.59 53.65,48.59 52.89,47.83 v1(52.89,46.88)
  Bottom Layer w0.254: 59.75,47.26 59.75,47.98 v1(59.15,48.59) ; v1(52.89,46.88) 52.89,45.32 51.16,43.58 49.4,43.58 48.94,44.04 OLED2.4
$1N1568: length 16.7
  Bottom Layer w0.254: C4.1 61.02,47.14 60,46.12 54.48,46.12 51.43,43.08 49.02,43.08 48.24,43.85 OLED2.5

## Copper pours and planes (outline as drawn; the poured copper is in the pictures)
GND on Top Layer: -3.69,74.7 79.12,74.7 79.12,-3.41 -3.69,-3.41
GND on Bottom Layer: -3.69,73.81 79.5,73.81 79.5,-2.14 -3.69,-2.14

## Text on the board
Bottom Layer: Design by: / naja / fitri
Bottom Silkscreen Layer: JLCJLCJLCJLC
